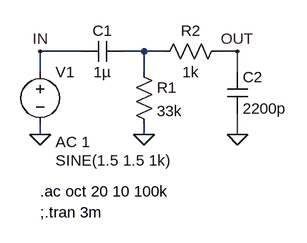
[diagram p0: schematic FV-1_Output_Circuit_ac.asc]
FV-1_Output_Circuit_ac.asc, the LTspice schematic file:
Version 4
SHEET 1 880 680
WIRE 176 48 112 48
WIRE 272 48 240 48
WIRE 304 48 272 48
WIRE 416 48 384 48
WIRE 112 80 112 48
WIRE 272 80 272 48
WIRE 416 80 416 48
WIRE 112 176 112 160
WIRE 272 176 272 160
WIRE 416 176 416 144
FLAG 112 176 0
FLAG 272 176 0
FLAG 416 176 0
FLAG 112 48 IN
FLAG 416 48 OUT
SYMBOL voltage 112 64 R0
WINDOW 3 24 152 Left 2
WINDOW 123 24 124 Left 2
WINDOW 39 0 0 Left 0
SYMATTR Value SINE(1.5 1.5 1k)
SYMATTR Value2 AC 1
SYMATTR InstName V1
SYMBOL cap 240 32 R90
WINDOW 0 0 32 VBottom 2
WINDOW 3 32 32 VTop 2
SYMATTR InstName C1
SYMATTR Value 1µ
SYMBOL cap 400 144 M180
WINDOW 0 24 56 Left 2
WINDOW 3 24 8 Left 2
SYMATTR InstName C2
SYMATTR Value 2200p
SYMBOL res 256 64 R0
SYMATTR InstName R1
SYMATTR Value 33k
SYMBOL res 400 32 R90
WINDOW 0 0 56 VBottom 2
WINDOW 3 32 56 VTop 2
SYMATTR InstName R2
SYMATTR Value 1k
TEXT 112 264 Left 2 !.ac oct 20 10 100k
TEXT 112 296 Left 2 !;.tran 3m

The netlist it stands for:
* FV-1_Output_Circuit_ac.asc
V1 IN 0 SINE(1.5 1.5 1k) AC 1
C1 N001 IN 1µ
C2 0 OUT 2200p
R1 N001 0 33k
R2 OUT N001 1k
.ac oct 20 10 100k
;.tran 3m
.backanno
.end